# Altium schematic sheet Image_SensorR2.SchDoc: Sony Image Sensor
size B; Revision: 1; SheetNumber: 2; SheetTotal: 5; RevisionHistory: Updated from v3.2 Miniscope.org
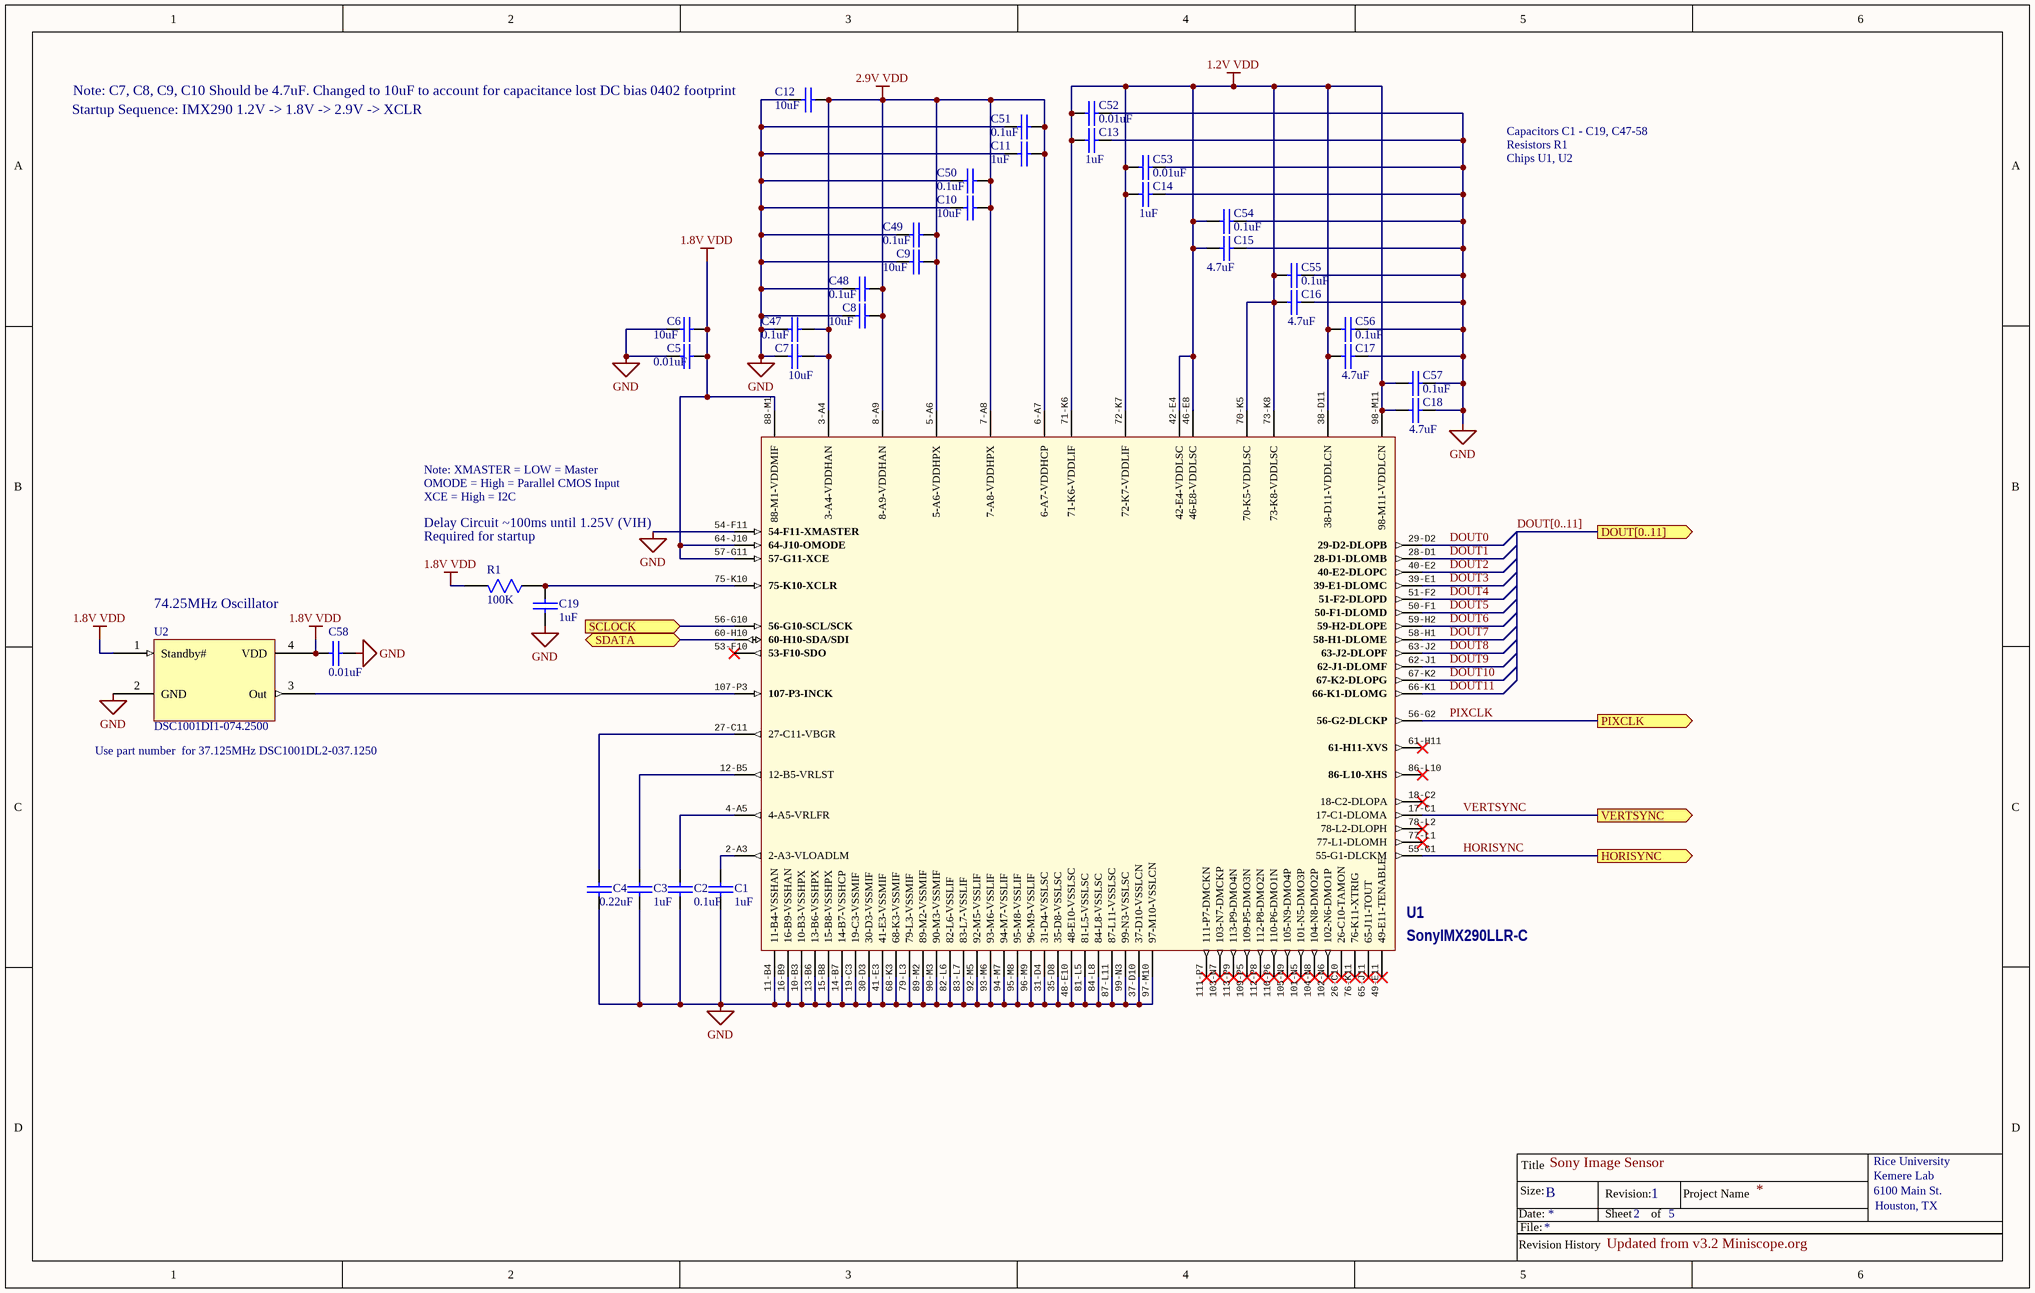
[diagram p0: Image_SensorR2.SchDoc]

## Parts
C1  1uF  [SMD CAP 0402]
C2  0.1uF  [SMD CAP 0402]
C3  1uF  [SMD CAP 0402]
C4  0.22uF  [SMD CAP 0402]
C5  0.01uF  [SMD CAP 0402]
C6  10uF  [SMD CAP 0402]
C7  10uF  [SMD CAP 0402]
C8  10uF  [SMD CAP 0402]
C9  10uF  [SMD CAP 0402]
C10  10uF  [SMD CAP 0402]
C11  1uF  [SMD CAP 0402]
C12  10uF  [SMD CAP 0402]
C13  1uF  [SMD CAP 0402]
C14  1uF  [SMD CAP 0402]
C15  4.7uF  [SMD CAP 0402]
C16  4.7uF  [SMD CAP 0402]
C17  4.7uF  [SMD CAP 0402]
C18  4.7uF  [SMD CAP 0402]
C19  1uF  [SMD CAP 0402]
C47  0.1uF  [SMD CAP 0402]
C48  0.1uF  [SMD CAP 0402]
C49  0.1uF  [SMD CAP 0402]
C50  0.1uF  [SMD CAP 0402]
C51  0.1uF  [SMD CAP 0402]
C52  0.01uF  [SMD CAP 0402]
C53  0.01uF  [SMD CAP 0402]
C54  0.1uF  [SMD CAP 0402]
C55  0.1uF  [SMD CAP 0402]
C56  0.1uF  [SMD CAP 0402]
C57  0.1uF  [SMD CAP 0402]
C58  0.01uF  [SMD CAP 0402]
R1  100K  [SMD RES 0402]
U1  SonyIMX290LLR-C  [110-LGA - Thin]
U2  DSC1001DI1-074.2500  [CDFN]

## Ports
DOUT[0..11] (out), HORISYNC (out), PIXCLK (out), SCLOCK (in), SDATA (bidir), VERTSYNC (out)

## Nets
1.2V VDD: C13.0 C14.0 C15.0 C16.0 C17.0 C18.0 C52.0 C53.0 C54.0 C55.0 C56.0 C57.0 U1.38-D11(38-D11-VDDLCN) U1.42-E4(42-E4-VDDLSC) U1.46-E8(46-E8-VDDLSC) U1.70-K5(70-K5-VDDLSC) U1.71-K6(71-K6-VDDLIF) U1.72-K7(72-K7-VDDLIF) U1.73-K8(73-K8-VDDLSC) U1.98-M11(98-M11-VDDLCN)
1.8V VDD: C5.1 C6.1 C58.1 R1.1 U1.57-G11(57-G11-XCE) U1.64-J10(64-J10-OMODE) U1.88-M1(88-M1-VDDMIF) U2.1(Standby#) U2.4(VDD)
2.9V VDD: C7.1 C8.1 C9.1 C10.1 C11.1 C12.1 C47.1 C48.1 C49.1 C50.1 C51.1 U1.3-A4(3-A4-VDDHAN) U1.5-A6(5-A6-VDDHPX) U1.6-A7(6-A7-VDDHCP) U1.7-A8(7-A8-VDDHPX) U1.8-A9(8-A9-VDDHAN)
GND: C1.0 C2.0 C3.0 C4.0 C5.0 C6.0 C7.0 C8.0 C9.0 C10.0 C11.0 C12.0 C13.1 C14.1 C15.1 C16.1 C17.1 C18.1 C19.0 C47.0 C48.0 C49.0 C50.0 C51.0 C52.1 C53.1 C54.1 C55.1 C56.1 C57.1 C58.0 U1.1-A1(1-A1-N.C.) U1.9-A11(9-A11-N.C.) U1.10-B3(10-B3-VSSHPX) U1.11-B4(11-B4-VSSHAN) U1.13-B6(13-B6-VSSHPX) U1.14-B7(14-B7-VSSHCP) U1.15-B8(15-B8-VSSHPX) U1.16-B9(16-B9-VSSHAN) U1.19-C3(19-C3-VSSMIF) U1.20-C4(20-C4-N.C.) U1.21-C5(21-C5-N.C.) U1.22-C6(22-C6-N.C.) U1.23-C7(23-C7-N.C.) U1.24-C8(24-C8-N.C.) U1.25-C9(25-C9-N.C.) U1.30-D3(30-D3-VSSMIF) U1.31-D4(31-D4-VSSLSC) U1.32-D5(32-D5-N.C.) U1.33-D6(33-D6-N.C.) U1.34-D7(34-D7-N.C.) U1.35-D8(35-D8-VSSLSC) U1.36-D9(36-D9-N.C.) U1.37-D10(37-D10-VSSLCN) U1.41-E3(41-E3-VSSMIF) U1.43-E5(43-E5-N.C.) U1.44-E6(44-E6-N.C.) U1.45-E7(45-E7-N.C.) U1.47-E9(47-E9-N.C.) U1.48-E10(48-E10-VSSLSC) U1.54-F11(54-F11-XMASTER) U1.68-K3(68-K3-VSSMIF) U1.69-K4(69-K4-N.C.) U1.74-K9(74-K9-N.C.) U1.79-L3(79-L3-VSSMIF) U1.80-L4(80-L4-N.C.) U1.81-L5(81-L5-VSSLSC) U1.82-L6(82-L6-VSSLIF) U1.83-L7(83-L7-VSSLIF) U1.84-L8(84-L8-VSSLSC) U1.85-L9(85-L9-N.C.) U1.87-L11(87-L11-VSSLSC) U1.89-M2(89-M2-VSSMIF) U1.90-M3(90-M3-VSSMIF) U1.91-M4(91-M4-N.C.) U1.92-M5(92-M5-VSSLIF) U1.93-M6(93-M6-VSSLIF) U1.94-M7(94-M7-VSSLIF) U1.95-M8(95-M8-VSSLIF) U1.96-M9(96-M9-VSSLIF) U1.97-M10(97-M10-VSSLCN) U1.99-N3(99-N3-VSSLSC) U1.100-N4(100-N4-N.C.) U1.106-P1(106-P1-N.C.) U1.108-P4(108-P4-N.C.) U1.114-P11(114-P11-N.C.) U2.2(GND)
DOUT0: U1.29-D2(29-D2-DLOPB)
DOUT1: U1.28-D1(28-D1-DLOMB)
DOUT2: U1.40-E2(40-E2-DLOPC)
DOUT3: U1.39-E1(39-E1-DLOMC)
DOUT4: U1.51-F2(51-F2-DLOPD)
DOUT5: U1.50-F1(50-F1-DLOMD)
DOUT6: U1.59-H2(59-H2-DLOPE)
DOUT7: U1.58-H1(58-H1-DLOME)
DOUT8: U1.63-J2(63-J2-DLOPF)
DOUT9: U1.62-J1(62-J1-DLOMF)
DOUT10: U1.67-K2(67-K2-DLOPG)
DOUT11: U1.66-K1(66-K1-DLOMG)
HORISYNC: U1.55-G1(55-G1-DLCKM) ; port HORISYNC
PIXCLK: U1.56-G2(56-G2-DLCKP) ; port PIXCLK
SCLOCK: U1.56-G10(56-G10-SCL/SCK) ; port SCLOCK
SDATA: U1.60-H10(60-H10-SDA/SDI) ; port SDATA
VERTSYNC: U1.17-C1(17-C1-DLOMA) ; port VERTSYNC
NetC1_1: C1.1 U1.2-A3(2-A3-VLOADLM)
NetC2_1: C2.1 U1.4-A5(4-A5-VRLFR)
NetC3_1: C3.1 U1.12-B5(12-B5-VRLST)
NetC4_1: C4.1 U1.27-C11(27-C11-VBGR)
NetC19_1: C19.1 R1.0 U1.75-K10(75-K10-XCLR)
NetU1_107-P3: U1.107-P3(107-P3-INCK) U2.3(Out)

Not connected (* = marked no-connect by the designer): U1 18-C2(18-C2-DLOPA)* 26-C10(26-C10-TAMON)* 49-E11(49-E11-TENABLE)* 53-F10(53-F10-SDO)* 61-H11(61-H11-XVS)* 65-J11(65-J11-TOUT)* 76-K11(76-K11-XTRIG)* 77-L1(77-L1-DLOMH)* 78-L2(78-L2-DLOPH)* 86-L10(86-L10-XHS)* 101-N5(101-N5-DMO3P)* 102-N6(102-N6-DMO1P)* 103-N7(103-N7-DMCKP)* 104-N8(104-N8-DMO2P)* 105-N9(105-N9-DMO4P)* 109-P5(109-P5-DMO3N)* 110-P6(110-P6-DMO1N)* 111-P7(111-P7-DMCKN)* 112-P8(112-P8-DMO2N)* 113-P9(113-P9-DMO4N)*

## Buses and harness runs
bus DOUT[0..11] = port DOUT[0..11]

## Notes on the sheet
- (near C12) Note: C7, C8, C9, C10 Should be 4.7uF. Changed to 10uF to account for capacitance lost DC bias 0402 footprint
- Startup Sequence: IMX290 1.2V -> 1.8V -> 2.9V -> XCLR
- Capacitors C1 - C19, C47-58
- Resistors R1
- Chips U1, U2
- Note: XMASTER = LOW = Master
- OMODE = High = Parallel CMOS Input
- XCE = High = I2C
- Delay Circuit ~100ms until 1.25V (VIH)
- Required for startup
- 74.25MHz Oscillator
- (near U2) Use part number  for 37.125MHz DSC1001DL2-037.1250
- Title
- Rice University
- Kemere Lab
- Date:
- Revision History
- Size:
- File:
- B
- Revision:
- Sheet
- of
- Project Name
- 6100 Main St.
- Houston, TX

## Library data of the parts
C1-C19 C47-C58 = Capacitor: Value: C?
R1 = Resistor: Value: ?
U1 = IMX290LLR-C: Sony Image Sensor
U2 = Microchip Oscillator: 74.25MHz Oscillator